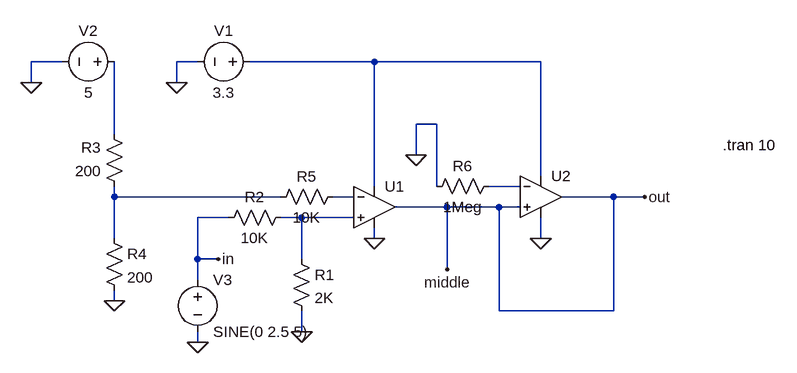
[diagram p0: schematic Draft1.asc]
Draft1.asc, the LTspice schematic file:
Version 4
SHEET 1 880 680
WIRE -320 -48 -368 -48
WIRE -112 -48 -144 -48
WIRE 160 -48 -32 -48
WIRE 416 -48 160 -48
WIRE -368 -16 -368 -48
WIRE -144 -16 -144 -48
WIRE 256 48 224 48
WIRE -240 64 -240 -48
WIRE 224 96 224 48
WIRE 416 128 416 -48
WIRE 160 144 160 -48
WIRE 256 144 256 48
WIRE 384 144 336 144
WIRE -240 160 -240 144
WIRE 16 160 -240 160
WIRE 128 160 96 160
WIRE 528 160 448 160
WIRE 576 160 528 160
WIRE 272 176 192 176
WIRE 352 176 272 176
WIRE 384 176 352 176
WIRE -64 192 -112 192
WIRE 48 192 16 192
WIRE 128 192 48 192
WIRE -240 224 -240 160
WIRE 160 224 160 208
WIRE 416 224 416 192
WIRE -112 256 -112 192
WIRE -80 256 -112 256
WIRE 48 256 48 192
WIRE 272 272 272 176
WIRE -112 288 -112 256
WIRE -240 320 -240 304
WIRE 352 336 352 176
WIRE 528 336 528 160
WIRE 528 336 352 336
WIRE 48 368 48 336
WIRE -112 384 -112 368
FLAG -240 320 0
FLAG 224 96 0
FLAG 48 368 0
FLAG 416 224 0
FLAG 160 224 0
FLAG -144 -16 0
FLAG -368 -16 0
FLAG -112 384 0
FLAG -80 256 in
FLAG 576 160 out
FLAG 272 272 middle
SYMBOL OpAmps\\UniversalOpamp 160 176 R0
SYMATTR InstName U1
SYMBOL OpAmps\\UniversalOpamp 416 160 R0
SYMATTR InstName U2
SYMBOL res 32 240 R0
SYMATTR InstName R1
SYMATTR Value 2K
SYMATTR SpiceLine tol=1 pwr=0.1
SYMBOL res 32 176 R90
WINDOW 0 0 56 VBottom 2
WINDOW 3 32 56 VTop 2
SYMATTR InstName R2
SYMATTR Value 10K
SYMATTR SpiceLine tol=1 pwr=0.1
SYMBOL res -224 160 R180
WINDOW 0 36 76 Left 2
WINDOW 3 36 40 Left 2
SYMATTR InstName R3
SYMATTR Value 200
SYMATTR SpiceLine tol=1 pwr=0.1
SYMBOL res -256 208 R0
SYMATTR InstName R4
SYMATTR Value 200
SYMATTR SpiceLine tol=1 pwr=0.1
SYMBOL res 112 144 R90
WINDOW 0 0 56 VBottom 2
WINDOW 3 32 56 VTop 2
SYMATTR InstName R5
SYMATTR Value 10K
SYMATTR SpiceLine tol=1 pwr=0.1
SYMBOL res 352 128 R90
WINDOW 0 0 56 VBottom 2
WINDOW 3 32 56 VTop 2
SYMATTR InstName R6
SYMATTR Value 1Meg
SYMATTR SpiceLine tol=1 pwr=0.1
SYMBOL voltage -16 -48 R90
WINDOW 0 -32 56 VBottom 2
WINDOW 3 32 56 VTop 2
WINDOW 123 0 0 Left 0
WINDOW 39 0 0 Left 0
SYMATTR InstName V1
SYMATTR Value 3.3
SYMBOL voltage -224 -48 R90
WINDOW 0 -32 56 VBottom 2
WINDOW 3 32 56 VTop 2
WINDOW 123 0 0 Left 0
WINDOW 39 0 0 Left 0
SYMATTR InstName V2
SYMATTR Value 5
SYMBOL voltage -112 272 R0
WINDOW 123 0 0 Left 0
WINDOW 39 0 0 Left 0
SYMATTR InstName V3
SYMATTR Value SINE(0 2.5 5)
TEXT 696 80 Left 2 !.tran 10

The netlist it stands for:
* Draft1.asc
XU1 N006 N005 N001 0 middle level1 Avol=1Meg GBW=10Meg Vos=0 En=0 Enk=0 In=0 Ink=0 Rin=500Meg  ; pins In+ In- V+ V- OUT
XU2 middle N003 N001 0 middle level1 Avol=1Meg GBW=10Meg Vos=0 En=0 Enk=0 In=0 Ink=0 Rin=500Meg  ; pins In+ In- V+ V- OUT
R1 N006 0 2K tol=1 pwr=0.1
R2 N006 in 10K tol=1 pwr=0.1
R3 N004 N002 200 tol=1 pwr=0.1
R4 N004 0 200 tol=1 pwr=0.1
R5 N005 N004 10K tol=1 pwr=0.1
R6 N003 0 1Meg tol=1 pwr=0.1
V1 N001 0 3.3
V2 N002 0 5
V3 in 0 SINE(0 2.5 5)
.tran 10
.lib UniversalOpAmp1.lib
.backanno
.end